# Altium schematic sheet Gyroscope Motion Sensor.SchDoc
size A
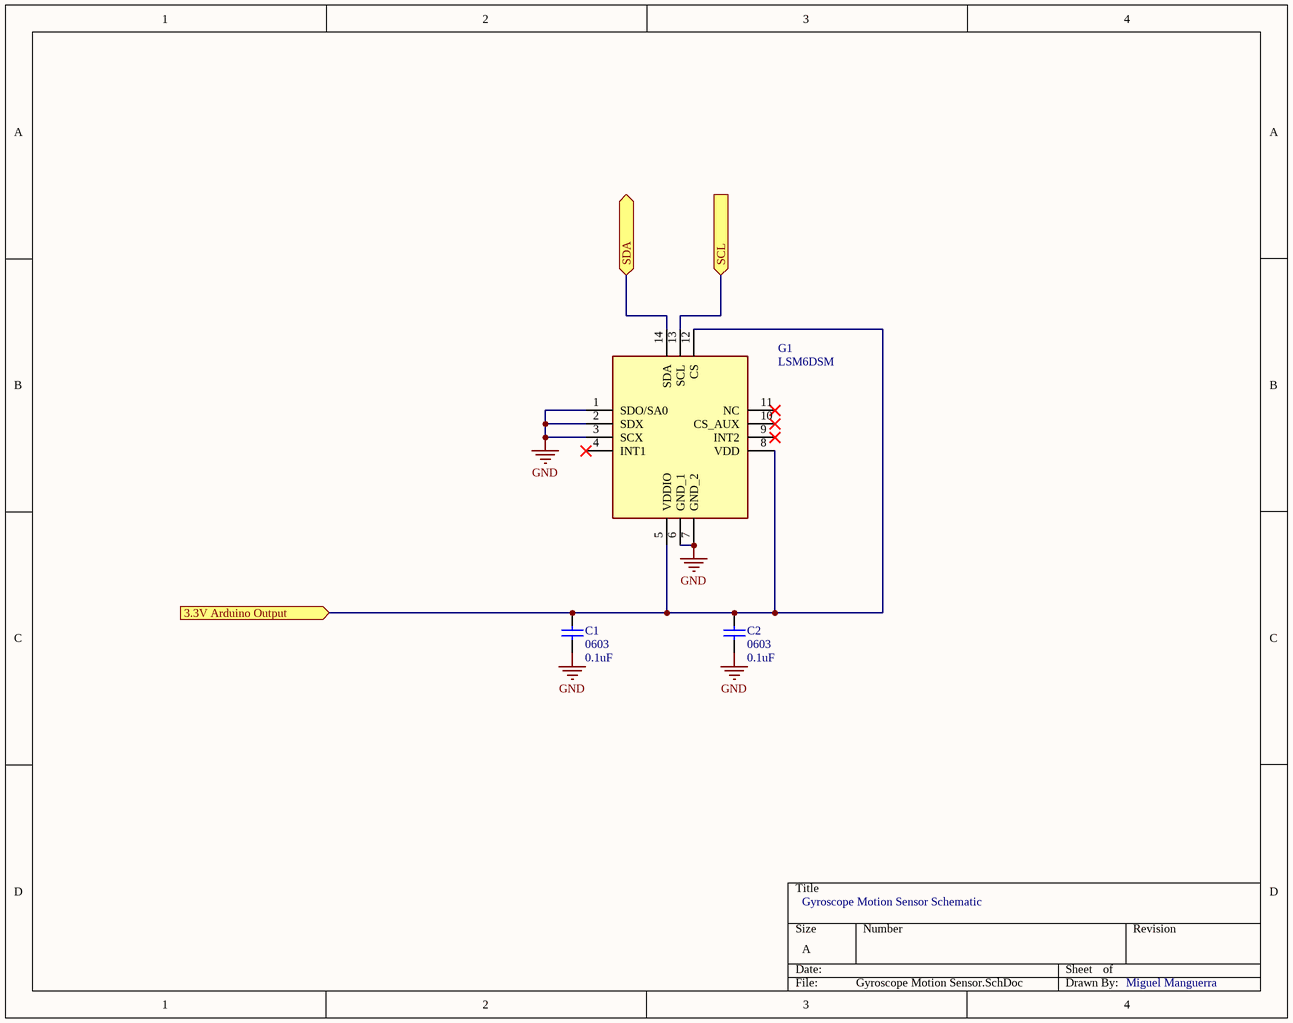
[diagram p0: Gyroscope Motion Sensor.SchDoc]

## Parts
C1  0603  value 0.1uF  [SMD-0603C]
C2  0603  value 0.1uF  [SMD-0603C]
G1  LSM6DSM  [LGA-14(2.5X3X0.86)]

## Ports
3.3V Arduino Output (in), SCL (in), SDA (bidir)

## Nets
GND: C1.1 C2.1 G1.1(SDO/SA0) G1.2(SDX) G1.3(SCX) G1.6(GND_1) G1.7(GND_2)
3.3V Arduino Output: C1.2 C2.2 G1.5(VDDIO) G1.8(VDD) G1.12(CS) ; port 3.3V Arduino Output
SCL: G1.13(SCL) ; port SCL
SDA: G1.14(SDA) ; port SDA

Not connected (* = marked no-connect by the designer): G1 4(INT1)* 9(INT2)* 10(CS_AUX)* 11(NC)*

## Notes on the sheet
- Gyroscope Motion Sensor Schematic
- Miguel Manguerra

## Library data of the parts
C1 C2 = Cap: Capacitor; Published: 8-Jun-2000; LatestRevisionDate: 17-Jul-2002; LatestRevisionNote: Re-released for DXP Platform.; PackageReference: RAD-0.3; Publisher: Altium Limited; PackageDescription: Radial Cap, Thru-Hole; 2 Leads; 0.3 in Pin Spacing
G1 = LSM6DS3HTR: Integrated Circuit; Manufacturer_Name: STMicroelectronics; Datasheet Link: http://www.st.com/content/ccc/resource/technical/document/datasheet/group0/38/96/79/af/ab/62/42/c3/DM00229854/files/DM00229854.pdf/jcr:content/translations/en.DM00229854.pdf; Manufacturer_Part_Number: LSM6DS3HTR; Mouser Part Number: 511-LSM6DS3HTR; Mouser Price/Stock: https://www.mouser.com/Search/Refine.aspx?Keyword=511-LSM6DS3HTR